# Altium schematic sheet Temp_Pressure.SchDoc
size A
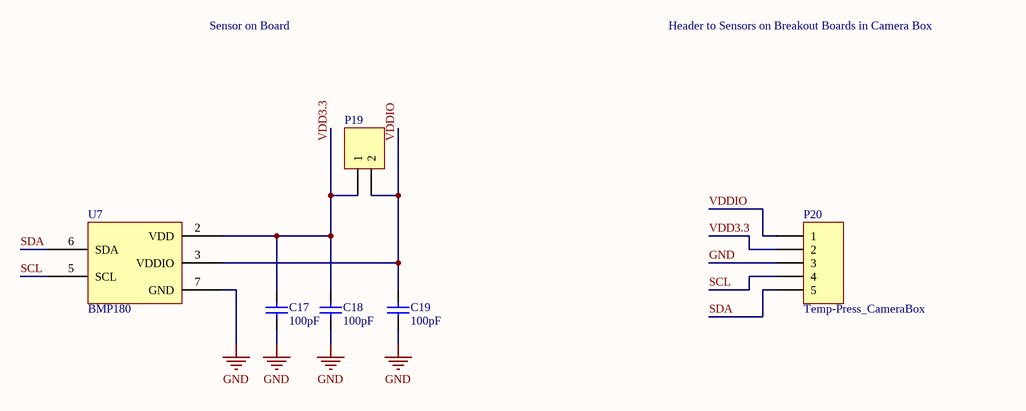
[diagram p0: Temp_Pressure.SchDoc]

## Parts
C17  value 100pF  [C1206]  (hidden comment: Cap Semi)
C18  value 100pF  [C1206]  (hidden comment: Cap Semi)
C19  value 100pF  [C1206]  (hidden comment: Cap Semi)
P19  Header 2  [HDR1X2]  (value not drawn)
P20  Temp-Press_CameraBox  [HDR1X5]
U7  BMP180  [BMP180]

## Nets
GND: C17.1 C18.1 C19.1 P20.3 U7.7(GND)
SCL: P20.4 U7.5(SCL)
SDA: P20.5 U7.6(SDA)
VDD3.3: C17.2 C18.2 P19.1 P20.2 U7.2(VDD)
VDDIO: C19.2 P19.2 P20.1 U7.3(VDDIO)

## Notes on the sheet
- Sensor on Board
- Header to Sensors on Breakout Boards in Camera Box

## Library data of the parts
C17-C19 = Cap Semi: Capacitor (Semiconductor SIM Model); Published: 8-Jun-2000; LatestRevisionDate: 29-May-2009; LatestRevisionNote: IPC-7351 Footprint Added.; PackageReference: C1206; Publisher: Altium Limited; PackageDescription: Chip Capacitor
P19 = Header 2: Header, 2-Pin; LatestRevisionDate: 17-Jul-2002; LatestRevisionNote: Re-released for DXP Platform.; Publisher: Altium Limited
P20 = Header 5: Header, 5-Pin; LatestRevisionDate: 17-Jul-2002; LatestRevisionNote: Re-released for DXP Platform.; Publisher: Altium Limited